# EAGLE design BatteryBoard (EAGLE 8.4.1)
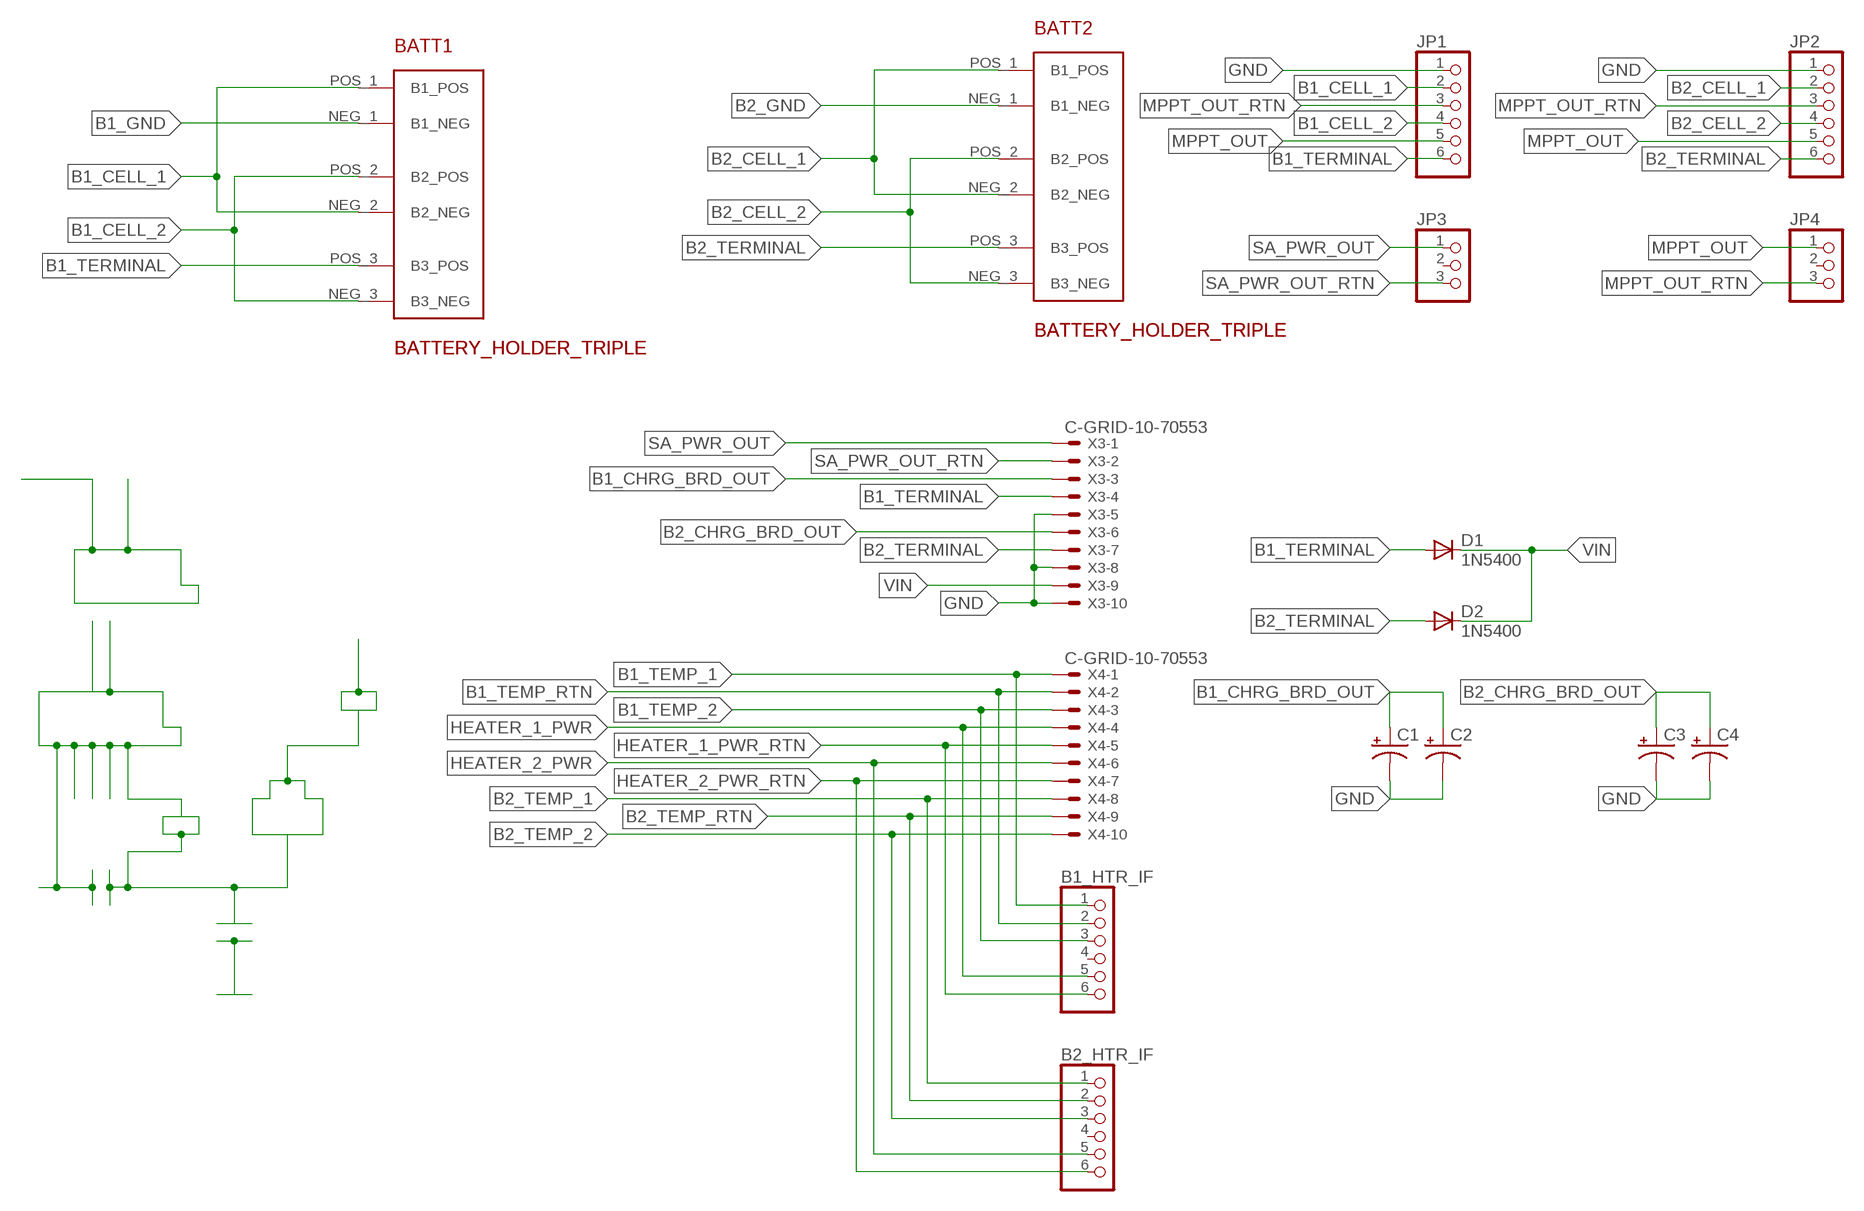
[diagram p0: schematic, sheet 1]

## Parts
B1_HTR_IF  PINHD-1X6CLEAN  [1X06-CLEAN]
B2_HTR_IF  PINHD-1X6CLEAN  [1X06-CLEAN]
BATT1  BATTERY_HOLDER_TRIPLE  [BATT_HOLDER_SINGLE]
BATT2  BATTERY_HOLDER_TRIPLE  [BATT_HOLDER_SINGLE]
C1  CPOL-USCT7343  [CT7343]
C2  CPOL-USCT7343  [CT7343]
C3  CPOL-USCT7343  [CT7343]
C4  CPOL-USCT7343  [CT7343]
D1  1N5400  [DO201-15]
D2  1N5400  [DO201-15]
JP1  PINHD-1X6CLEAN  [1X06-CLEAN]
JP2  PINHD-1X6CLEAN  [1X06-CLEAN]
JP3  PINHD-1X3  [1X03]
JP4  PINHD-1X3  [1X03]
X3  C-GRID-10-70553  [70553-10]
X4  C-GRID-10-70553  [70553-10]

## Nets
B1_CELL_1: BATT1.NEG_2(B2_NEG) BATT1.POS_1(B1_POS) JP1.2
B1_CELL_2: BATT1.NEG_3(B3_NEG) BATT1.POS_2(B2_POS) JP1.4
B1_CHRG_BRD_OUT: C1.+ C2.+ X3.3
B1_GND: BATT1.NEG_1(B1_NEG)
B1_TEMP_1: B1_HTR_IF.1 X4.1
B1_TEMP_2: B1_HTR_IF.3 X4.3
B1_TEMP_RTN: B1_HTR_IF.2 X4.2
B1_TERMINAL: BATT1.POS_3(B3_POS) D1.A JP1.6 X3.4
B2_CELL_1: BATT2.NEG_2(B2_NEG) BATT2.POS_1(B1_POS) JP2.2
B2_CELL_2: BATT2.NEG_3(B3_NEG) BATT2.POS_2(B2_POS) JP2.4
B2_CHRG_BRD_OUT: C3.+ C4.+ X3.6
B2_GND: BATT2.NEG_1(B1_NEG)
B2_TEMP_1: B2_HTR_IF.1 X4.8
B2_TEMP_2: B2_HTR_IF.3 X4.10
B2_TEMP_RTN: B2_HTR_IF.2 X4.9
B2_TERMINAL: BATT2.POS_3(B3_POS) D2.A JP2.6 X3.7
GND: C1.- C2.- C3.- C4.- JP1.1 JP2.1 X3.5 X3.8 X3.10
HEATER_1_PWR: B1_HTR_IF.5 X4.4
HEATER_1_PWR_RTN: B1_HTR_IF.6 X4.5
HEATER_2_PWR: B2_HTR_IF.5 X4.6
HEATER_2_PWR_RTN: B2_HTR_IF.6 X4.7
MPPT_OUT: JP1.5 JP2.5 JP4.1
MPPT_OUT_RTN: JP1.3 JP2.3 JP4.3
SA_PWR_OUT: JP3.1 X3.1
SA_PWR_OUT_RTN: JP3.3 X3.2
VIN: D1.C D2.C X3.9
Unconnected: B1_HTR_IF.4 B2_HTR_IF.4 JP3.2 JP4.2

## Library data of the parts
B1_HTR_IF B2_HTR_IF JP1 JP2 = adafruit:PINHD-1X6: PIN HEADER
BATT1 BATT2 = Battery_Holder_Triple:BATTERY_HOLDER_TRIPLE
C1-C4 = adafruit:CPOL-US: POLARIZED CAPACITOR, American symbol
D1 D2 = diode:1N5400: DIODE standard rectifier, 3 A, 50 V (Motorola)
JP3 JP4 = adafruit:PINHD-1X3: PIN HEADER
X3 X4 = con-molex:C-GRID-10: CONNECTOR wire to board 2.54 mm (0.100") pitch header; OC_FARNELL: unknown; OC_NEWARK: unknown

## Board
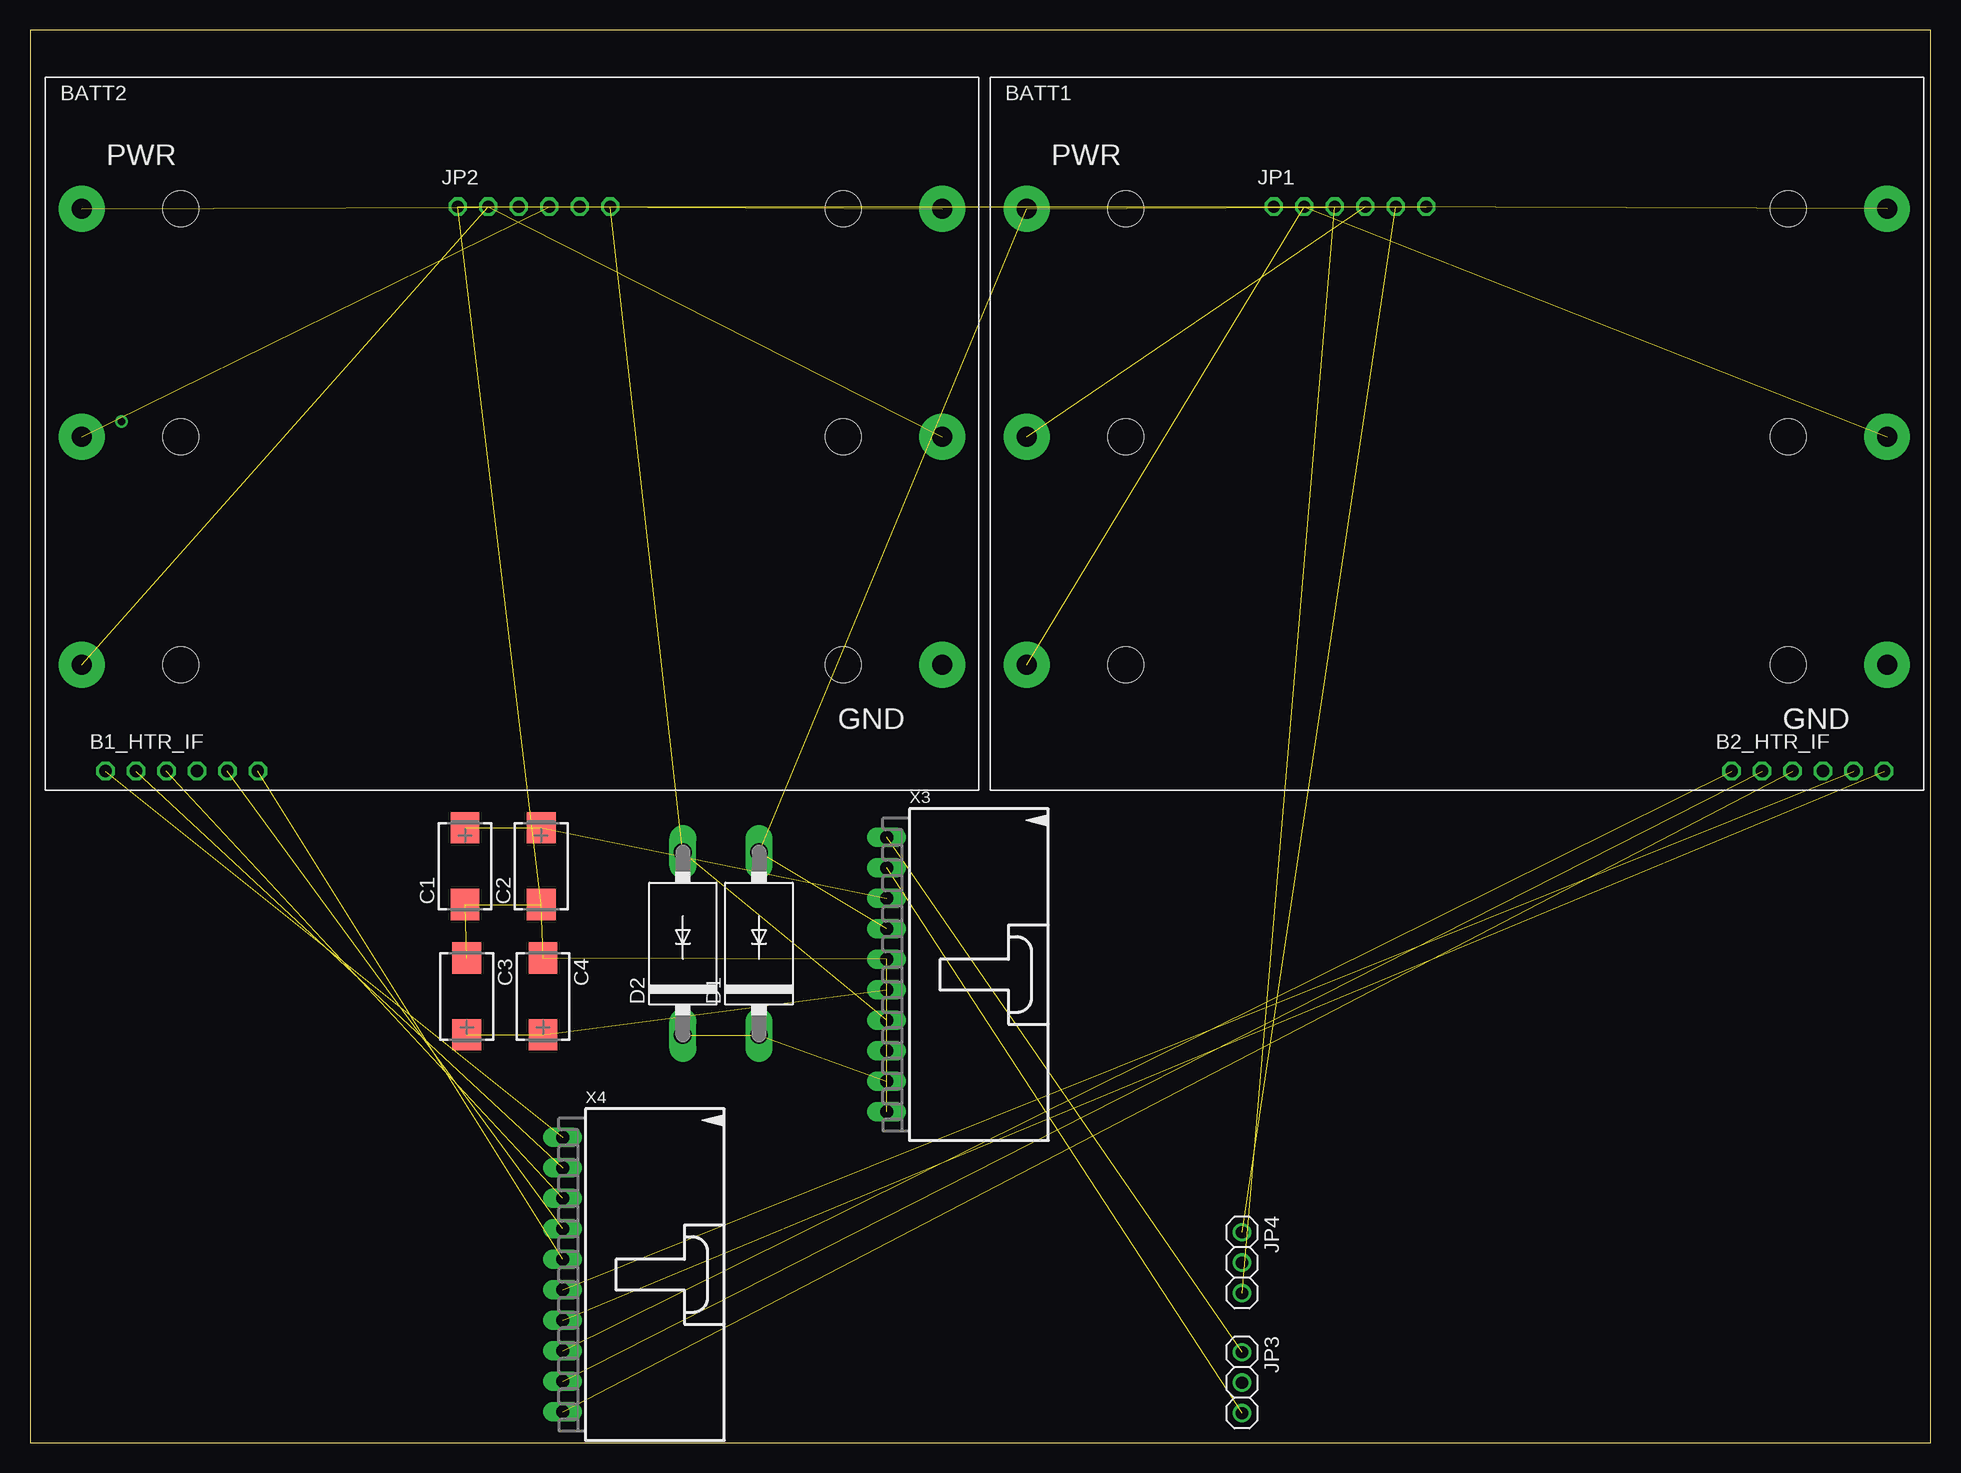
[diagram p1: board, top side]

Size 158.4 x 117.72 mm. Coordinates in mm from the lower left corner, seen from the top.
Outline: 0,0 158.4,0 158.4,117.72 0,117.72 0,0
Copper layers (1*16): Top 0.035mm / dielectric 1.5mm / Bottom 0.035mm
Design rules "default": minimum track width 6mil, minimum drill 0.35mm, track to track 6mil, track to pad 6mil, pad to pad 6mil, via to via 6mil, smd to smd 6mil, copper to edge 40mil, drill to drill 6mil, minimum pad ring 10mil, minimum via ring 8mil, stop-mask expansion 4mil, vias tented up to drill 0mil, thermal gap 10mil

### Footprints (pad centres in the part's own frame; a part is rotated, then mirrored left to right if it is on the bottom)
1X06-CLEAN = drill 1.016 octagon: 1 -6.35,0; 2 -3.81,0; 3 -1.27,0; 4 1.27,0; 5 3.81,0; 6 6.35,0
BATT_HOLDER_SINGLE = drill 1.65 pad 3.81: NEG_1 74.75,10.45; NEG_2 74.75,29.45; NEG_3 74.75,48.45; POS_1 3.05,10.45; POS_2 3.05,29.45; POS_3 3.05,48.45 | hole 3: 11.3,10.45; 66.5,10.45; 11.3,29.45; 66.5,29.45; 11.3,48.45; 66.5,48.45
CT7343 = smd 2.6 x 2.4: + 3.2,0; - -3.2,0
DO201-15 = drill 1.499 long: A 7.62,0; C -7.62,0
1X03 = drill 1.016: 1 -2.54,0; 2 0,0; 3 2.54,0
70553-10 = drill 1.092 long: 1 -11.43,-7.62; 2 -8.89,-7.62; 3 -6.35,-7.62; 4 -3.81,-7.62; 5 -1.27,-7.62; 6 1.27,-7.62; 7 3.81,-7.62; 8 6.35,-7.62; 9 8.89,-7.62; 10 11.43,-7.62

### Placement (x,y rotation side)
B1_HTR_IF  12.64,55.97 0 top
B2_HTR_IF  148.15,55.97 0 top
BATT1  80.01,54.37 0 top
BATT2  1.27,54.37 0 top
C1  36.25,48.04 90 top
C2  42.6,48.04 90 top
C3  36.4,37.18 270 top
C4  42.75,37.18 270 top
D1  60.75,41.59 90 top
D2  54.4,41.59 90 top
JP1  110,103 0 top
JP2  42,103 0 top
JP3  101,5 270 top
JP4  101,15 270 top
X3  79,39 270 top
X4  52,14 270 top

### Tracks (layer width: path | path; a pad name or v marks a point on that pad's centre or on a via)
B1_CELL_1  (2 unrouted)
B1_CELL_2  (2 unrouted)
B1_CHRG_BRD_OUT  (2 unrouted)
B1_TEMP_1  (1 unrouted)
B1_TEMP_2  (1 unrouted)
B1_TEMP_RTN  (1 unrouted)
B1_TERMINAL  (3 unrouted)
B2_CELL_1  (2 unrouted)
B2_CELL_2  (2 unrouted)
B2_CHRG_BRD_OUT  (2 unrouted)
B2_TEMP_1  (1 unrouted)
B2_TEMP_2  (1 unrouted)
B2_TEMP_RTN  (1 unrouted)
B2_TERMINAL  (3 unrouted)
GND  (8 unrouted)
HEATER_1_PWR  (1 unrouted)
HEATER_1_PWR_RTN  (1 unrouted)
HEATER_2_PWR  (1 unrouted)
HEATER_2_PWR_RTN  (1 unrouted)
MPPT_OUT  (2 unrouted)
MPPT_OUT_RTN  (2 unrouted)
N$7  (via drill 0.65)
  other vias: 7.62,85.09
SA_PWR_OUT  (1 unrouted)
SA_PWR_OUT_RTN  (1 unrouted)
VIN  (2 unrouted)